# EAGLE schematic FPGA_DENDY_LAT (EAGLE 9.4.2)
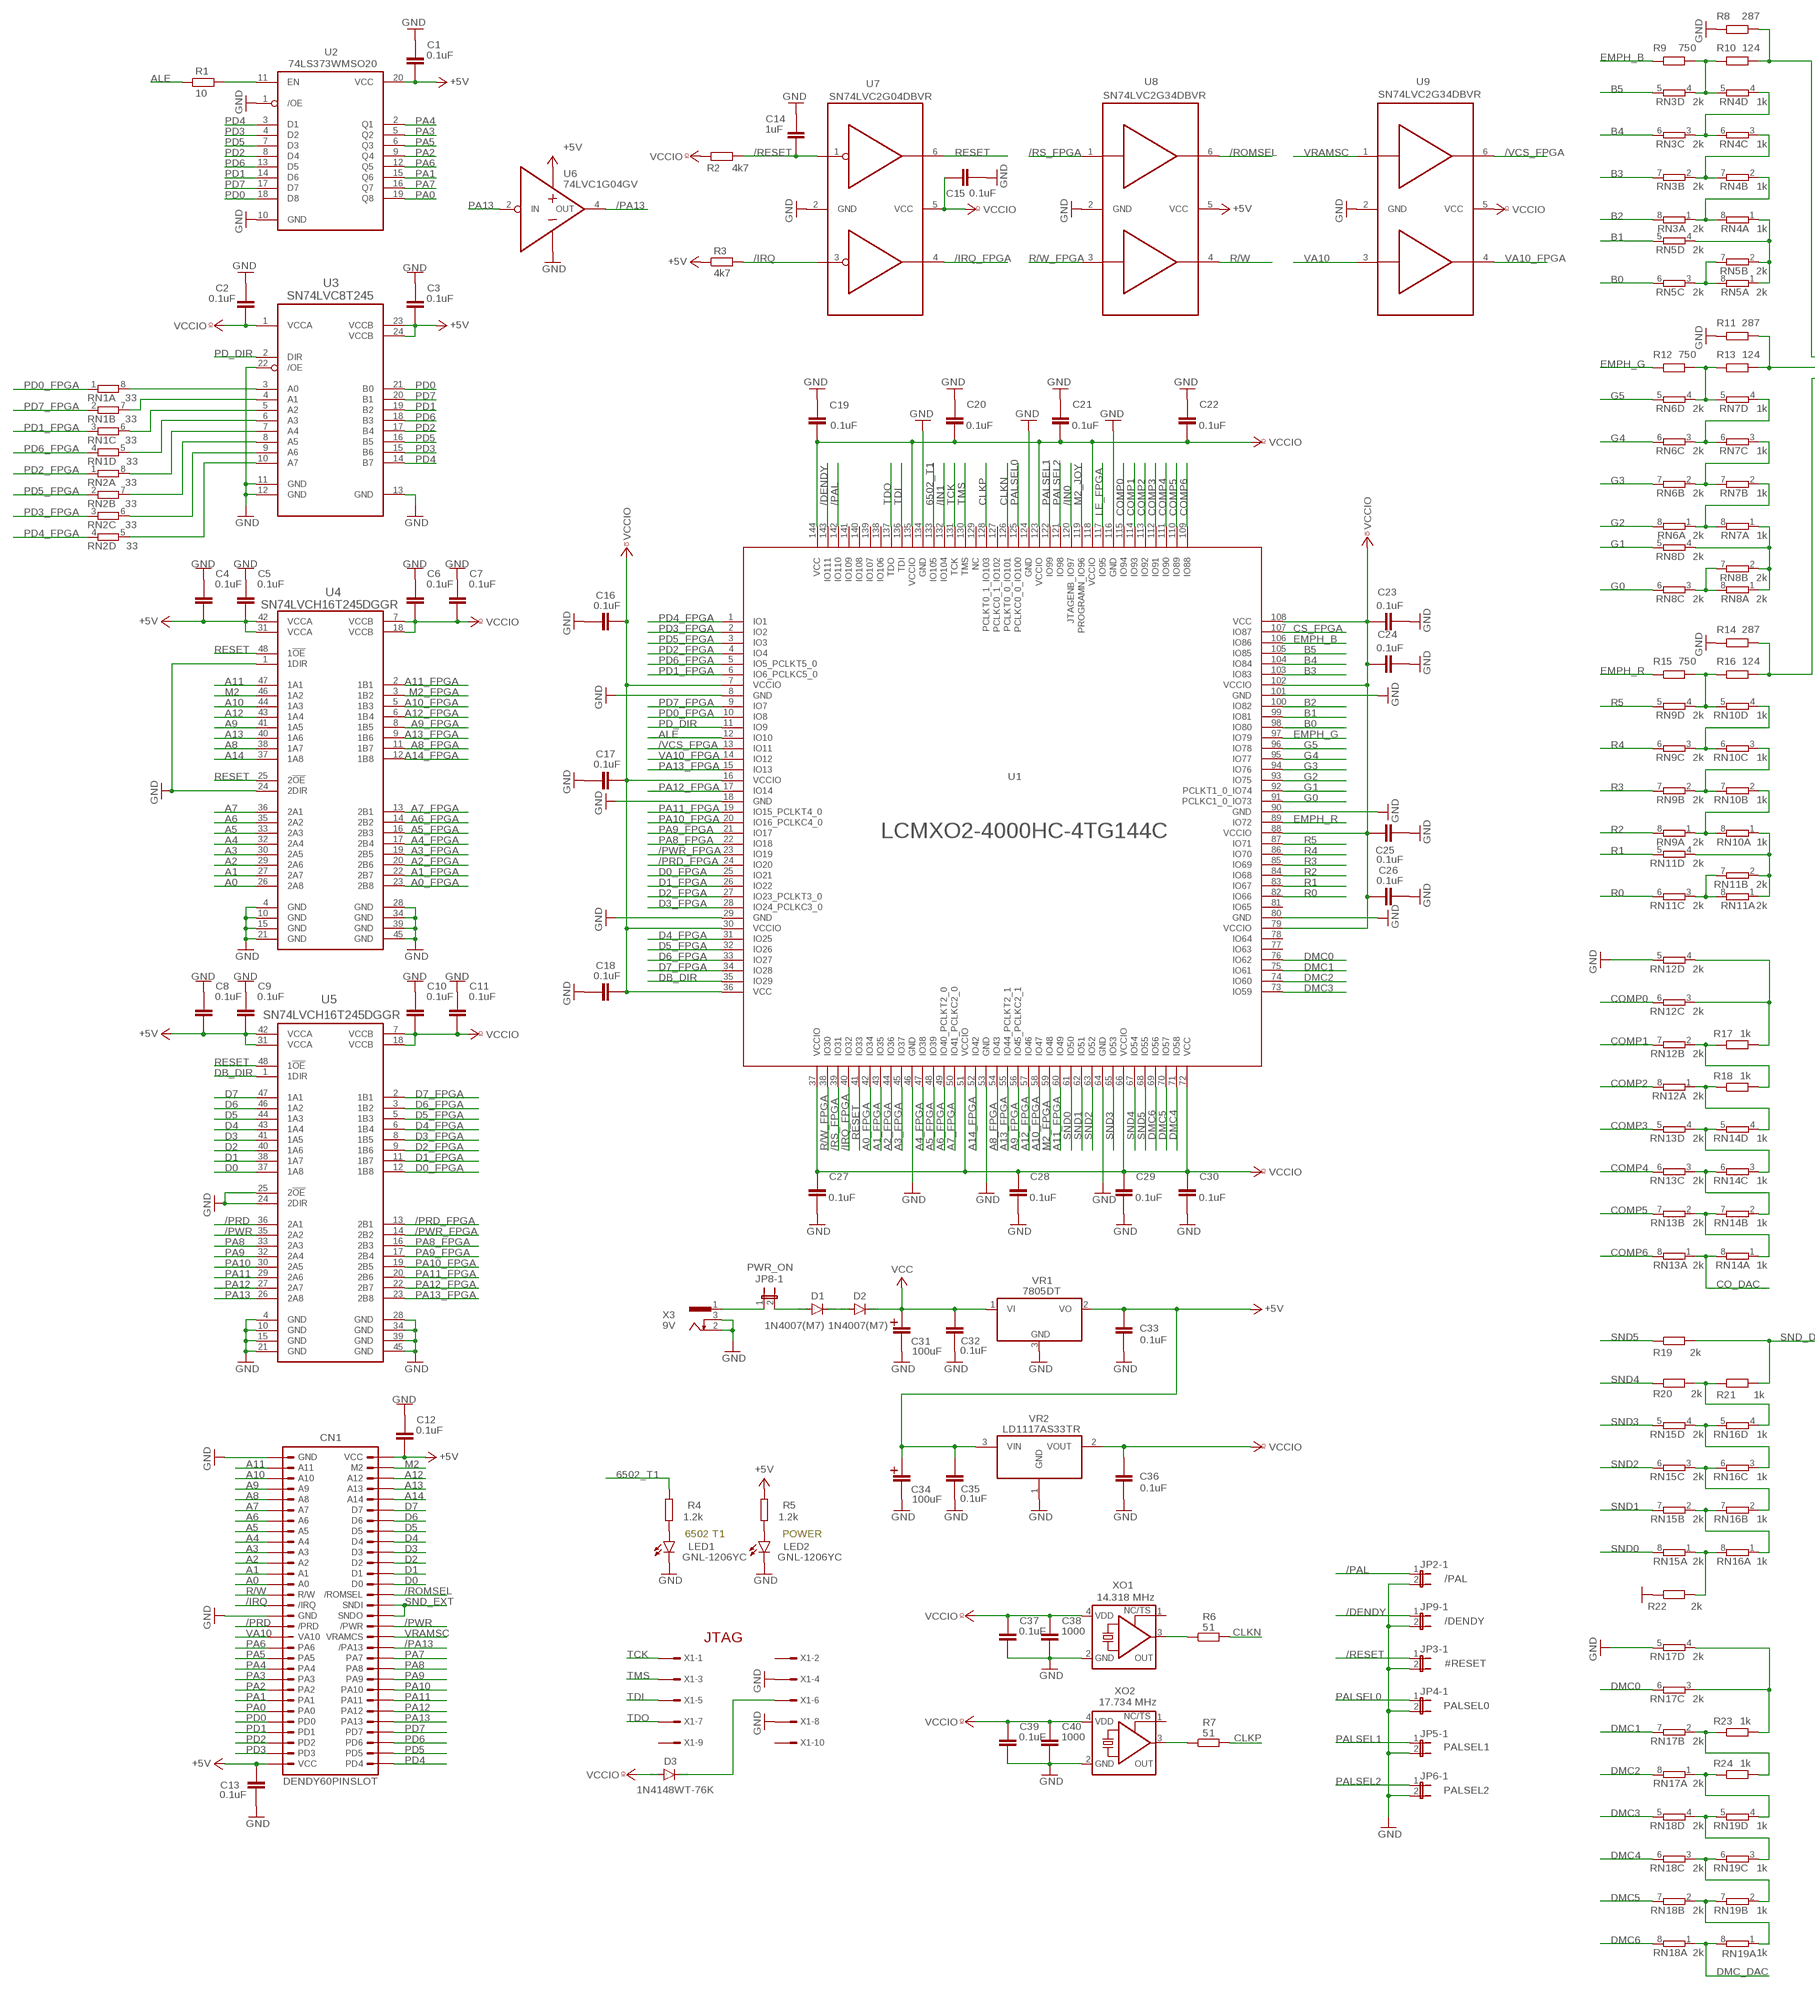
[diagram p0: schematic, sheet 1, part 1 of 2]
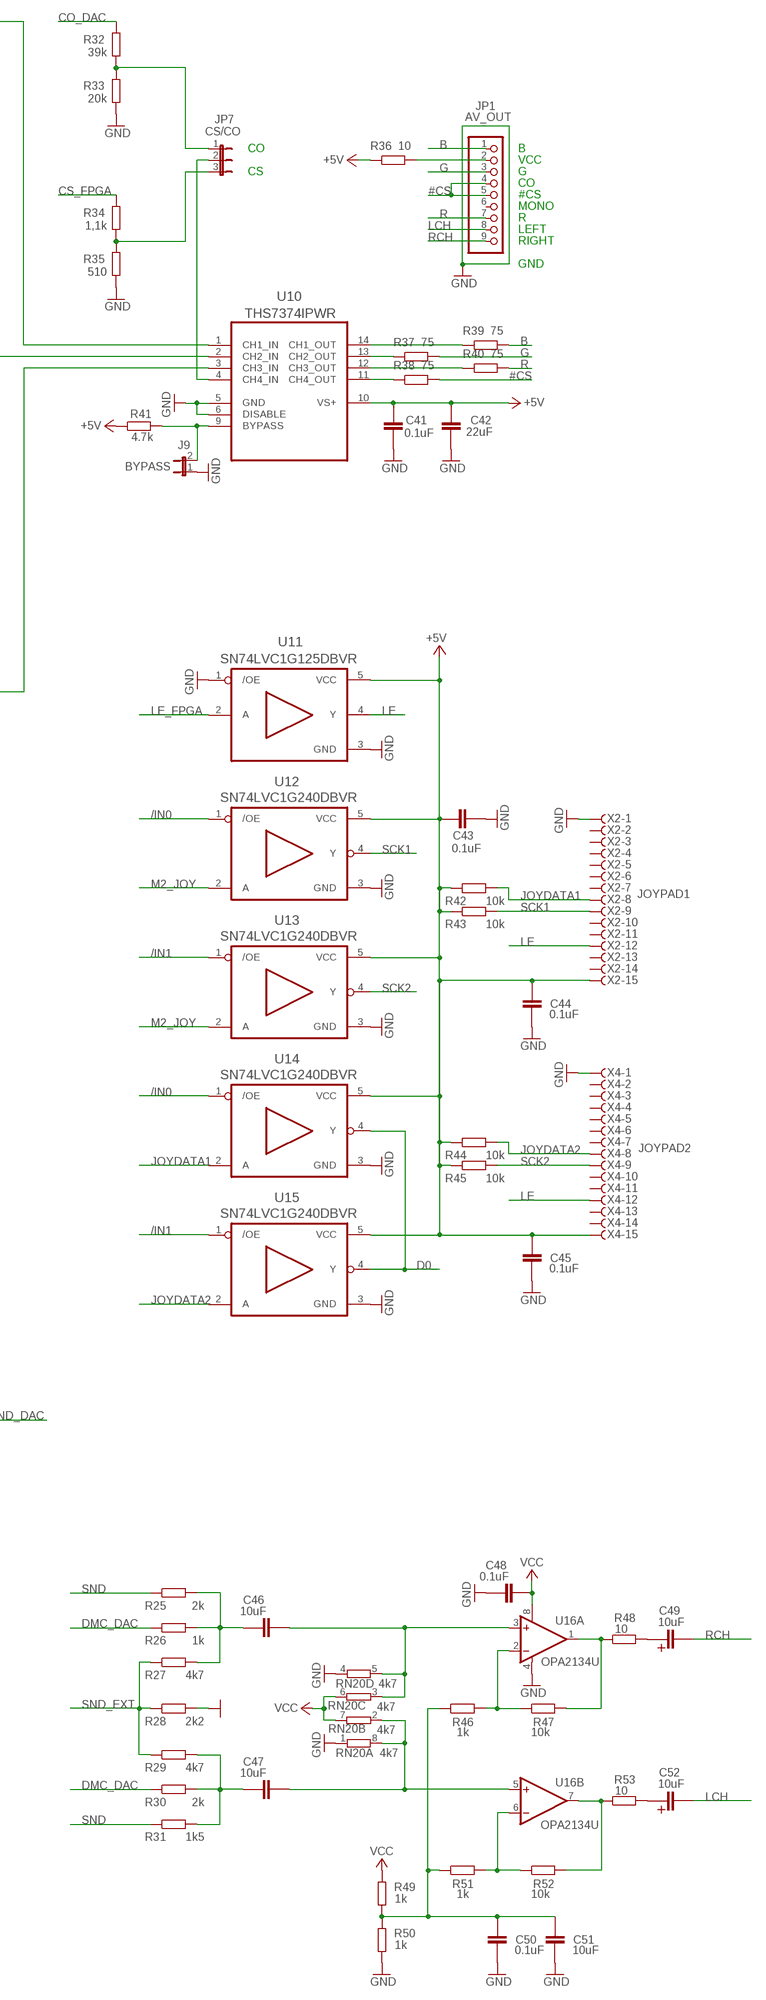
[diagram p1: schematic, sheet 1, part 2 of 2]

## Parts
C1  0.1uF  C-EUC0805  [C0805]
C2  0.1uF  C-EUC0805  [C0805]
C3  0.1uF  C-EUC0805  [C0805]
C4  0.1uF  C-EUC0805  [C0805]
C5  0.1uF  C-EUC0805  [C0805]
C6  0.1uF  C-EUC0805  [C0805]
C7  0.1uF  C-EUC0805  [C0805]
C8  0.1uF  C-EUC0805  [C0805]
C9  0.1uF  C-EUC0805  [C0805]
C10  0.1uF  C-EUC0805  [C0805]
C11  0.1uF  C-EUC0805  [C0805]
C12  0.1uF  C-EUC0805  [C0805]
C13  0.1uF  C-EUC0805  [C0805]
C14  1uF  C-EUC0805  [C0805]
C15  0.1uF  C-EUC0805  [C0805]
C16  0.1uF  C-EUC0805  [C0805]
C17  0.1uF  C-EUC0805  [C0805]
C18  0.1uF  C-EUC0805  [C0805]
C19  0.1uF  C-EUC0805  [C0805]
C20  0.1uF  C-EUC0805  [C0805]
C21  0.1uF  C-EUC0805  [C0805]
C22  0.1uF  C-EUC0805  [C0805]
C23  0.1uF  C-EUC0805  [C0805]
C24  0.1uF  C-EUC0805  [C0805]
C25  0.1uF  C-EUC0805  [C0805]
C26  0.1uF  C-EUC0805  [C0805]
C27  0.1uF  C-EUC0805  [C0805]
C28  0.1uF  C-EUC0805  [C0805]
C29  0.1uF  C-EUC0805  [C0805]
C30  0.1uF  C-EUC0805  [C0805]
C31  100uF  CPOL-EU153CLV-0505  [153CLV-0505]
C32  0.1uF  C-EUC0805  [C0805]
C33  0.1uF  C-EUC0805  [C0805]
C34  100uF  CPOL-EU153CLV-0505  [153CLV-0505]
C35  0.1uF  C-EUC0805  [C0805]
C36  0.1uF  C-EUC0805  [C0805]
C37  0.1uF  C-EUC0805  [C0805]
C38  1000  C-EUC0805  [C0805]
C39  0.1uF  C-EUC0805  [C0805]
C40  1000  C-EUC0805  [C0805]
C41  0.1uF  C-EUC0603  [C0603]
C42  22uF  C-EUC0603  [C0603]
C43  0.1uF  C-EUC0603  [C0603]
C44  0.1uF  C-EUC0805  [C0805]
C45  0.1uF  C-EUC0805  [C0805]
C46  10uF  C-EUC0805  [C0805]
C47  10uF  C-EUC0805  [C0805]
C48  0.1uF  C-EUC0805  [C0805]
C49  10uF  CPOL-EU153CLV-0505  [153CLV-0505]
C50  0.1uF  C-EUC0805  [C0805]
C51  10uF  C-EUC0805  [C0805]
C52  10uF  CPOL-EU153CLV-0505  [153CLV-0505]
CN1  DENDY60PINSLOT  [60PINDENDY]
D1  1N4007(M7)  DIODE-DO-214AC  [DO-214AC]
D2  1N4007(M7)  DIODE-DO-214AC  [DO-214AC]
D3  1N4148WT-76K  DIODE-DO214AA  [DO214AA]
J9  BYPASS  JP1E  [JP1]
JP1  AV_OUT  PINHD-1X9  [1X09]
JP2  /PAL  JP4QE  [JP4Q]
JP3  #RESET  JP4QE  [JP4Q]
JP4  PALSEL0  JP4QE  [JP4Q]
JP5  PALSEL1  JP4QE  [JP4Q]
JP6  PALSEL2  JP4QE  [JP4Q]
JP7  CS/CO  JP2W  [JP2W]
JP8  PWR_ON  JP4QE  [JP4Q]
JP9  /DENDY  JP4QE  [JP4Q]
LED1  GNL-1206YC  LEDSML1206  [SML1206]
LED2  GNL-1206YC  LEDSML1206  [SML1206]
R1  10  R-EU_R0805  [R0805]
R2  4k7  R-EU_R0805  [R0805]
R3  4k7  R-EU_R0805  [R0805]
R4  1.2k  R-EU_R0805  [R0805]
R5  1.2k  R-EU_R0805  [R0805]
R6  51  R-EU_R0805  [R0805]
R7  51  R-EU_R0805  [R0805]
R8  287  R-EU_R0805  [R0805]
R9  750  R-EU_R0805  [R0805]
R10  124  R-EU_R0805  [R0805]
R11  287  R-EU_R0805  [R0805]
R12  750  R-EU_R0805  [R0805]
R13  124  R-EU_R0805  [R0805]
R14  287  R-EU_R0805  [R0805]
R15  750  R-EU_R0805  [R0805]
R16  124  R-EU_R0805  [R0805]
R17  1k  R-EU_R0805  [R0805]
R18  1k  R-EU_R0805  [R0805]
R19  2k  R-EU_R0805  [R0805]
R20  2k  R-EU_R0805  [R0805]
R21  1k  R-EU_R0805  [R0805]
R22  2k  R-EU_R0805  [R0805]
R23  1k  R-EU_R0805  [R0805]
R24  1k  R-EU_R0805  [R0805]
R25  2k  R-EU_R0805  [R0805]
R26  1k  R-EU_R0805  [R0805]
R27  4k7  R-EU_R0805  [R0805]
R28  2k2  R-EU_R0805  [R0805]
R29  4k7  R-EU_R0805  [R0805]
R30  2k  R-EU_R0805  [R0805]
R31  1k5  R-EU_R0805  [R0805]
R32  39k  R-EU_R0805  [R0805]
R33  20k  R-EU_R0805  [R0805]
R34  1,1k  R-EU_R0805  [R0805]
R35  510  R-EU_R0805  [R0805]
R36  10  R-EU_R0805  [R0805]
R37  75  R-EU_R0805  [R0805]
R38  75  R-EU_R0805  [R0805]
R39  75  R-EU_R0805  [R0805]
R40  75  R-EU_R0805  [R0805]
R41  4.7k  R-EU_R0805  [R0805]
R42  10k  R-EU_R0805  [R0805]
R43  10k  R-EU_R0805  [R0805]
R44  10k  R-EU_R0805  [R0805]
R45  10k  R-EU_R0805  [R0805]
R46  1k  R-EU_R0805  [R0805]
R47  10k  R-EU_R0805  [R0805]
R48  10  R-EU_R0805  [R0805]
R49  1k  R-EU_R0805  [R0805]
R50  1k  R-EU_R0805  [R0805]
R51  1k  R-EU_R0805  [R0805]
R52  10k  R-EU_R0805  [R0805]
R53  10  R-EU_R0805  [R0805]
RN1  33  4R-N0603-ARC  [0603-ARC]
RN2  33  4R-N0603-ARC  [0603-ARC]
RN3  2k  4R-N0603-ARC  [0603-ARC]
RN4  1k  4R-N0603-ARC  [0603-ARC]
RN5  2k  4R-N0603-ARC  [0603-ARC]
RN6  2k  4R-N0603-ARC  [0603-ARC]
RN7  1k  4R-N0603-ARC  [0603-ARC]
RN8  2k  4R-N0603-ARC  [0603-ARC]
RN9  2k  4R-N0603-ARC  [0603-ARC]
RN10  1k  4R-N0603-ARC  [0603-ARC]
RN11  2k  4R-N0603-ARC  [0603-ARC]
RN12  2k  4R-N0603-ARC  [0603-ARC]
RN13  2k  4R-N0603-ARC  [0603-ARC]
RN14  1k  4R-N0603-ARC  [0603-ARC]
RN15  2k  4R-N0603-ARC  [0603-ARC]
RN16  1k  4R-N0603-ARC  [0603-ARC]
RN17  2k  4R-N0603-ARC  [0603-ARC]
RN18  2k  4R-N0603-ARC  [0603-ARC]
RN19  1k  4R-N0603-ARC  [0603-ARC]
RN20  4k7  4R-N0603-ARC  [0603-ARC]
U1  LCMXO2-4000HC-4TG144C  LCMXO2-4000HC  [TQFP144]
U2  74LS373WMSO20  [SO20W]
U3  SN74LVC8T245  [SOP65P640X110-24N]
U4  SN74LVCH16T245DGGR  [SOP50P810X120-48N]
U5  SN74LVCH16T245DGGR  [SOP50P810X120-48N]
U6  74LVC1G04GV  [SOT95P275X110-5N]
U7  SN74LVC2G04DBVR  [SOT-23-6]
U8  SN74LVC2G34DBVR  [SOT-23-6]
U9  SN74LVC2G34DBVR  [SOT-23-6]
U10  THS7374IPWR  [SOP65P640X120-14N]
U11  SN74LVC1G125DBVR  [SOT95P280X145-5N]
U12  SN74LVC1G240DBVR  [SOT95P280X145-5N]
U13  SN74LVC1G240DBVR  [SOT95P280X145-5N]
U14  SN74LVC1G240DBVR  [SOT95P280X145-5N]
U15  SN74LVC1G240DBVR  [SOT95P280X145-5N]
U16  OPA2134U  [SO08]
VR1  7805DT  [TO252]
VR2  LD1117AS33TR  [SOT230P700X180-4N]
X1  057-010-1  [057-010-1]
X2  JOYPAD1  F15HPS  [F15HP]
X3  9V  733980-62  [733980-62]
X4  JOYPAD2  F15HPS  [F15HP]
XO1  14.318 MHz  KXO-PXO/XO-V97  [7.0X5.08_KXO-(V)97]
XO2  17.734 MHz  KXO-PXO/XO-V95  [2.5X2.0_KXO-V95]

## Nets
6502_T1: R4.2 U1.133(IO105)
#CS: JP1.4 JP1.5 R38.2
+5V: C1.2 C3.2 C4.2 C5.2 C8.2 C9.2 C12.2 C13.1 C33.1 C34.+ C35.1 C41.2 C42.2 C43.2 C44.1 C45.1 CN1.A30(VCC) CN1.B1(VCC) R3.1 R5.2 R36.1 R41.1 R42.1 R43.1 R44.1 R45.1 U2.20(VCC) U3.23(VCCB) U3.24(VCCB) U4.31(VCCA) U4.42(VCCA) U5.31(VCCA) U5.42(VCCA) U6.5(VCC) U8.5(VCC) U10.10(VS+) U11.5(VCC) U12.5(VCC) U13.5(VCC) U14.5(VCC) U15.5(VCC) VR1.2(VO) VR2.3(VIN) X2.15(-15:F) X4.15(-15:F)
/DENDY: JP9.1 U1.143(IO111)
/IN0: U1.120(JTAGENB_IO97) U12.1(/OE) U14.1(/OE)
/IN1: U1.132(IO104) U13.1(/OE) U15.1(/OE)
/IRQ: CN1.A15(/IRQ) R3.2 U7.3(IN2)
/IRQ_FPGA: U1.40(IO32) U7.4(OUT2)
/PA13: CN1.B19(/PA13) U6.4(OUT)
/PAL: JP2.1 U1.142(IO110)
/PRD: CN1.A17(/PRD) U5.36(2A1)
/PRD_FPGA: U1.24(IO20) U5.13(2B1)
/PWR: CN1.B17(/PWR) U5.35(2A2)
/PWR_FPGA: U1.23(IO19) U5.14(2B2)
/RESET: C14.2 JP3.1 R2.2 U7.1(IN1)
/ROMSEL: CN1.B14(/ROMSEL) U8.6(OUT1)
/RS_FPGA: U1.39(IO31) U8.1(IN1)
/VCS_FPGA: U1.13(IO11) U9.6(OUT1)
A0: CN1.A13(A0) U4.26(2A8)
A0_FPGA: U1.42(IO34) U4.23(2B8)
A1: CN1.A12(A1) U4.27(2A7)
A1_FPGA: U1.43(IO35) U4.22(2B7)
A2: CN1.A11(A2) U4.29(2A6)
A2_FPGA: U1.44(IO36) U4.20(2B6)
A3: CN1.A10(A3) U4.30(2A5)
A3_FPGA: U1.45(IO37) U4.19(2B5)
A4: CN1.A9(A4) U4.32(2A4)
A4_FPGA: U1.47(IO38) U4.17(2B4)
A5: CN1.A8(A5) U4.33(2A3)
A5_FPGA: U1.48(IO39) U4.16(2B3)
A6: CN1.A7(A6) U4.35(2A2)
A6_FPGA: U1.49(IO40_PCLKT2_0) U4.14(2B2)
A7: CN1.A6(A7) U4.36(2A1)
A7_FPGA: U1.50(IO41_PCLKC2_0) U4.13(2B1)
A8: CN1.A5(A8) U4.38(1A7)
A8_FPGA: U1.54(IO43) U4.11(1B7)
A9: CN1.A4(A9) U4.41(1A5)
A9_FPGA: U1.56(IO45_PCLKC2_1) U4.8(1B5)
A10: CN1.A3(A10) U4.44(1A3)
A10_FPGA: U1.58(IO47) U4.5(1B3)
A11: CN1.A2(A11) U4.47(1A1)
A11_FPGA: U1.60(IO49) U4.2(1B1)
A12: CN1.B3(A12) U4.43(1A4)
A12_FPGA: U1.57(IO46) U4.6(1B4)
A13: CN1.B4(A13) U4.40(1A6)
A13_FPGA: U1.55(IO44_PCLKT2_1) U4.9(1B6)
A14: CN1.B5(A14) U4.37(1A8)
A14_FPGA: U1.52(IO42) U4.12(1B8)
ALE: R1.1 U1.12(IO10)
B: JP1.1 R39.2
B0: RN5.6 U1.98(IO80)
B1: RN5.5 U1.99(IO81)
B2: RN3.8 U1.100(IO82)
B3: RN3.7 U1.103(IO83)
B4: RN3.6 U1.104(IO84)
B5: RN3.5 U1.105(IO85)
CLKN: R6.2 U1.126(PCLKT0_0_IO101)
CLKP: R7.2 U1.128(PCLKT0_1_IO103)
CO_DAC: R32.2 RN13.1 RN14.8
COMP0: RN12.6 U1.115(IO94)
COMP1: RN12.7 U1.114(IO93)
COMP2: RN12.8 U1.113(IO92)
COMP3: RN13.5 U1.112(IO91)
COMP4: RN13.6 U1.111(IO90)
COMP5: RN13.7 U1.110(IO89)
COMP6: RN13.8 U1.109(IO88)
CS_FPGA: R34.2 U1.107(IO87)
D0: CN1.B13(D0) U5.37(1A8) U14.4(Y) U15.4(Y)
D0_FPGA: U1.25(IO21) U5.12(1B8)
D1: CN1.B12(D1) U5.38(1A7)
D1_FPGA: U1.26(IO22) U5.11(1B7)
D2: CN1.B11(D2) U5.40(1A6)
D2_FPGA: U1.27(IO23_PCLKT3_0) U5.9(1B6)
D3: CN1.B10(D3) U5.41(1A5)
D3_FPGA: U1.28(IO24_PCLKC3_0) U5.8(1B5)
D4: CN1.B9(D4) U5.43(1A4)
D4_FPGA: U1.31(IO25) U5.6(1B4)
D5: CN1.B8(D5) U5.44(1A3)
D5_FPGA: U1.32(IO26) U5.5(1B3)
D6: CN1.B7(D6) U5.46(1A2)
D6_FPGA: U1.33(IO27) U5.3(1B2)
D7: CN1.B6(D7) U5.47(1A1)
D7_FPGA: U1.34(IO28) U5.2(1B1)
DB_DIR: U1.35(IO29) U5.1(1DIR)
DMC0: RN17.6 U1.76(IO62)
DMC1: RN17.7 U1.75(IO61)
DMC2: RN17.8 U1.74(IO60)
DMC3: RN18.5 U1.73(IO59)
DMC4: RN18.6 U1.71(IO58)
DMC5: RN18.7 U1.70(IO57)
DMC6: RN18.8 U1.69(IO56)
DMC_DAC: R26.1 R30.1 RN18.1 RN19.8
EMPH_B: R9.1 U1.106(IO86)
EMPH_G: R12.1 U1.97(IO79)
EMPH_R: R15.1 U1.89(IO72)
G: JP1.3 R37.2
G0: RN8.6 U1.91(PCLKC1_0_IO73)
G1: RN8.5 U1.92(PCLKT1_0_IO74)
G2: RN6.8 U1.93(IO75)
G3: RN6.7 U1.94(IO76)
G4: RN6.6 U1.95(IO77)
G5: RN6.5 U1.96(IO78)
GND: C1.1 C2.1 C3.1 C4.1 C5.1 C6.1 C7.1 C8.1 C9.1 C10.1 C11.1 C12.1 C13.2 C14.1 C15.2 C16.1 C17.1 C18.1 C19.2 C20.1 C21.1 C22.1 C23.2 C24.2 C25.2 C26.2 C27.2 C28.2 C29.2 C30.2 C31.- C32.2 C33.2 C34.- C35.2 C36.2 C37.2 C38.2 C39.2 C40.2 C41.1 C42.1 C43.1 C44.2 C45.2 C48.1 C50.2 C51.2 CN1.A1(GND) CN1.A16(GND) J9.1 JP2.2 JP3.2 JP4.2 JP5.2 JP6.2 JP9.2 LED1.C LED2.C R8.1 R11.1 R14.1 R22.1 R28.2 R33.1 R35.1 R50.2 RN12.5 RN17.5 RN20.1 RN20.4 U1.8(GND) U1.18(GND) U1.29(GND) U1.46(GND) U1.53(GND) U1.64(GND) U1.80(GND) U1.90(GND) U1.101(GND) U1.116(GND) U1.124(GND) U1.134(GND) U2.1(/OE) U2.10(GND) U3.11(GND) U3.12(GND) U3.13(GND) U3.22(/OE) U4.1(1DIR) U4.4(GND) U4.10(GND) U4.15(GND) U4.21(GND) U4.24(2DIR) U4.28(GND) U4.34(GND) U4.39(GND) U4.45(GND) U5.4(GND) U5.10(GND) U5.15(GND) U5.21(GND) U5.24(2DIR) U5.25(2!OE) U5.28(GND) U5.34(GND) U5.39(GND) U5.45(GND) U6.3(GND) U7.2(GND) U8.2(GND) U9.2(GND) U10.5(GND) U10.6(DISABLE) U11.1(/OE) U11.3(GND) U12.3(GND) U13.3(GND) U14.3(GND) U15.3(GND) U16.4(A:V-) VR1.3(GND) VR2.1(GND) X1.4 X1.8 X2.1(-1:F) X3.2 X3.3 X4.1(-1:F) XO1.2(GND) XO2.2(GND)
JOYDATA1: R42.2 U14.2(A) X2.8(-8:F)
JOYDATA2: R44.2 U15.2(A) X4.8(-8:F)
LCH: C52.- JP1.8
LE: U11.4(Y) X2.12(-12:F) X4.12(-12:F)
LE_FPGA: U1.117(IO95) U11.2(A)
M2: CN1.B2(M2) U4.46(1A2)
M2_FPGA: U1.59(IO48) U4.3(1B2)
M2_JOY: U1.119(PROGRAMN_IO96) U12.2(A) U13.2(A)
N$1: C46.1 R25.2 R26.2 R27.2
N$2: R7.1 XO2.3(OUT)
N$3: D3.C X1.6
N$4: C46.2 RN20.3 RN20.5 U16.3(A:+IN)
N$5: RN18.2 RN19.1 RN19.7
N$6: R6.1 XO1.3(OUT)
N$7: C47.2 RN20.2 RN20.8 U16.5(B:+IN)
N$8: R20.2 R21.1 RN16.4
N$9: RN1.8 U3.3(A0)
N$10: RN1.7 U3.4(A1)
N$11: RN13.2 RN14.1 RN14.7
N$12: RN1.6 U3.5(A2)
N$13: RN1.5 U3.6(A3)
N$14: R9.2 R10.1 RN3.4 RN4.5
N$15: R51.2 R52.1 U16.6(B:-IN)
N$16: RN3.3 RN4.4 RN4.6
N$17: RN2.8 U3.7(A4)
N$18: RN3.2 RN4.3 RN4.7
N$19: JP7.3 R34.1 R35.2
N$20: RN13.3 RN14.2 RN14.6
N$21: RN13.4 RN14.3 RN14.5
N$22: R17.2 RN12.3 RN12.4
N$23: RN3.1 RN4.2 RN4.8
N$24: R12.2 R13.1 RN6.4 RN7.5
N$25: RN6.3 RN7.4 RN7.6
N$26: RN6.2 RN7.3 RN7.7
N$27: RN4.1 RN5.1 RN5.2 RN5.4
N$28: RN6.1 RN7.2 RN7.8
N$29: RN5.3 RN5.7 RN5.8
N$30: C47.1 R29.2 R30.2 R31.2
N$31: RN2.7 U3.8(A5)
N$32: RN2.6 U3.9(A6)
N$33: RN7.1 RN8.1 RN8.2 RN8.4
N$34: R15.2 R16.1 RN9.4 RN10.5
N$35: RN9.3 RN10.4 RN10.6
N$36: RN8.3 RN8.7 RN8.8
N$37: C49.+ R48.2
N$38: R11.2 R13.2 U10.2(CH2_IN)
N$39: RN9.2 RN10.3 RN10.7
N$40: RN9.1 RN10.2 RN10.8
N$41: RN10.1 RN11.1 RN11.2 RN11.4
N$42: R46.2 R47.1 U16.2(A:-IN)
N$43: R47.2 R48.1 U16.1(A:OUT)
N$44: R52.2 R53.1 U16.7(B:OUT)
N$45: C52.+ R53.2
N$46: R18.1 RN12.1 RN14.4
N$47: R17.1 R18.2 RN12.2
N$49: JP7.1 R32.1 R33.2
N$50: JP1.2 R36.2
N$52: R1.2 U2.11(EN)
N$53: R14.2 R16.2 U10.3(CH3_IN)
N$54: LED1.A R4.1
N$55: RN15.4 RN16.3 RN16.5
N$56: J9.2 R41.2 U10.9(BYPASS)
N$57: RN15.3 RN16.2 RN16.6
N$58: R8.2 R10.2 U10.1(CH1_IN)
N$59: RN15.2 RN16.1 RN16.7
N$60: R22.2 RN15.1 RN16.8
N$61: RN2.5 U3.10(A7)
N$62: JP7.2 U10.4(CH4_IN)
N$63: LED2.A R5.1
N$64: R39.1 U10.14(CH1_OUT)
N$65: R37.1 U10.13(CH2_OUT)
N$66: R40.1 U10.12(CH3_OUT)
N$67: R38.1 U10.11(CH4_OUT)
N$68: RN18.3 RN19.2 RN19.6
N$69: RN18.4 RN19.3 RN19.5
N$70: R23.2 RN17.3 RN17.4
N$71: RN11.3 RN11.7 RN11.8
N$72: R24.1 RN17.1 RN19.4
N$73: R23.1 R24.2 RN17.2
N$75: D1.A JP8.2
N$76: D1.C D2.A
N$77: JP8.1 X3.1
PA0: CN1.A25(PA0) U2.19(Q8)
PA1: CN1.A24(PA1) U2.15(Q6)
PA2: CN1.A23(PA2) U2.9(Q4)
PA3: CN1.A22(PA3) U2.5(Q2)
PA4: CN1.A21(PA4) U2.2(Q1)
PA5: CN1.A20(PA5) U2.6(Q3)
PA6: CN1.A19(PA6) U2.12(Q5)
PA7: CN1.B20(PA7) U2.16(Q7)
PA8: CN1.B21(PA8) U5.33(2A3)
PA8_FPGA: U1.22(IO18) U5.16(2B3)
PA9: CN1.B22(PA9) U5.32(2A4)
PA9_FPGA: U1.21(IO17) U5.17(2B4)
PA10: CN1.B23(PA10) U5.30(2A5)
PA10_FPGA: U1.20(IO16_PCLKC4_0) U5.19(2B5)
PA11: CN1.B24(PA11) U5.29(2A6)
PA11_FPGA: U1.19(IO15_PCLKT4_0) U5.20(2B6)
PA12: CN1.B25(PA12) U5.27(2A7)
PA12_FPGA: U1.17(IO14) U5.22(2B7)
PA13: CN1.B26(PA13) U5.26(2A8) U6.2(IN)
PA13_FPGA: U1.15(IO13) U5.23(2B8)
PALSEL0: JP4.1 U1.125(PCLKC0_0_IO100)
PALSEL1: JP5.1 U1.122(IO99)
PALSEL2: JP6.1 U1.121(IO98)
PD0: CN1.A26(PD0) U2.18(D8) U3.21(B0)
PD0_FPGA: RN1.1 U1.10(IO8)
PD1: CN1.A27(PD1) U2.14(D6) U3.19(B2)
PD1_FPGA: RN1.3 U1.6(IO6_PCLKC5_0)
PD2: CN1.A28(PD2) U2.8(D4) U3.17(B4)
PD2_FPGA: RN2.1 U1.4(IO4)
PD3: CN1.A29(PD3) U2.4(D2) U3.15(B6)
PD3_FPGA: RN2.3 U1.2(IO2)
PD4: CN1.B30(PD4) U2.3(D1) U3.14(B7)
PD4_FPGA: RN2.4 U1.1(IO1)
PD5: CN1.B29(PD5) U2.7(D3) U3.16(B5)
PD5_FPGA: RN2.2 U1.3(IO3)
PD6: CN1.B28(PD6) U2.13(D5) U3.18(B3)
PD6_FPGA: RN1.4 U1.5(IO5_PCLKT5_0)
PD7: CN1.B27(PD7) U2.17(D7) U3.20(B1)
PD7_FPGA: RN1.2 U1.9(IO7)
PD_DIR: U1.11(IO9) U3.2(DIR)
R: JP1.7 R40.2
R0: RN11.6 U1.82(IO66)
R1: RN11.5 U1.83(IO67)
R2: RN9.8 U1.84(IO68)
R3: RN9.7 U1.85(IO69)
R4: RN9.6 U1.86(IO70)
R5: RN9.5 U1.87(IO71)
R/W: CN1.A14(R/W) U8.4(OUT2)
R/W_FPGA: U1.38(IO30) U8.3(IN2)
RCH: C49.- JP1.9
RESET: U1.41(IO33) U4.25(2!OE) U4.48(1!OE) U5.48(1!OE) U7.6(OUT1)
SCK1: R43.2 U12.4(Y) X2.9(-9:F)
SCK2: R45.2 U13.4(Y) X4.9(-9:F)
SND: R25.1 R31.1
SND0: RN15.8 U1.61(IO50)
SND1: RN15.7 U1.62(IO51)
SND2: RN15.6 U1.63(IO52)
SND3: RN15.5 U1.65(IO53)
SND4: R20.1 U1.67(IO54)
SND5: R19.1 U1.68(IO55)
SND_DAC: R19.2 R21.2
SND_EXT: CN1.B15(SNDI) CN1.B16(SNDO) R27.1 R28.1 R29.1
TCK: U1.131(TCK) X1.1
TDI: U1.136(TDI) X1.5
TDO: U1.137(TDO) X1.7
TMS: U1.130(TMS) X1.3
VA10: CN1.A18(VA10) U9.3(IN2)
VA10_FPGA: U1.14(IO12) U9.4(OUT2)
VCC: C31.+ C32.1 C48.2 D2.C R49.1 RN20.6 RN20.7 U16.8(A:V+) VR1.1(VI)
VCCIO: C2.2 C6.2 C7.2 C10.2 C11.2 C15.1 C16.2 C17.2 C18.2 C19.1 C20.2 C21.2 C22.2 C23.1 C24.1 C25.1 C26.1 C27.1 C28.1 C29.1 C30.1 C36.1 C37.1 C38.1 C39.1 C40.1 D3.A R2.1 U1.7(VCCIO) U1.16(VCCIO) U1.30(VCCIO) U1.36(VCC) U1.37(VCCIO) U1.51(VCCIO) U1.66(VCCIO) U1.72(VCC) U1.79(VCCIO) U1.88(VCCIO) U1.102(VCCIO) U1.108(VCC) U1.118(VCCIO) U1.123(VCCIO) U1.135(VCCIO) U1.144(VCC) U3.1(VCCA) U4.7(VCCB) U4.18(VCCB) U5.7(VCCB) U5.18(VCCB) U7.5(VCC) U9.5(VCC) VR2.2(VOUT) XO1.4(VDD) XO2.4(VDD)
VPPL3: C50.1 C51.1 R46.1 R49.2 R50.1 R51.1
VRAMSC: CN1.B18(VRAMCS) U9.1(IN1)
Unconnected: JP1.6 JP2.3 JP2.4 JP2.5 JP2.6 JP2.7 JP2.8 JP3.3 JP3.4 JP3.5 JP3.6 JP3.7 JP3.8 JP4.3 JP4.4 JP4.5 JP4.6 JP4.7 JP4.8 JP5.3 JP5.4 JP5.5 JP5.6 JP5.7 JP5.8 JP6.3 JP6.4 JP6.5 JP6.6 JP6.7 JP6.8 JP8.3 JP8.4 JP8.5 JP8.6 JP8.7 JP8.8 JP9.3 JP9.4 JP9.5 JP9.6 JP9.7 JP9.8 U1.77(IO63) U1.78(IO64) U1.81(IO65) U1.127(PCLKC0_1_IO102) U1.129(NC) U1.138(IO106) U1.139(IO107) U1.140(IO108) U1.141(IO109) X1.2 X1.9 X1.10 X2.2(-2:F) X2.3(-3:F) X2.4(-4:F) X2.5(-5:F) X2.6(-6:F) X2.7(-7:F) X2.10(-10:F) X2.11(-11:F) X2.13(-13:F) X2.14(-14:F) X2.G1(-G:G1) X2.G2(-G:G2) X4.2(-2:F) X4.3(-3:F) X4.4(-4:F) X4.5(-5:F) X4.6(-6:F) X4.7(-7:F) X4.10(-10:F) X4.11(-11:F) X4.13(-13:F) X4.14(-14:F) X4.G1(-G:G1) X4.G2(-G:G2) XO1.1(TS) XO2.1(TS)

## Notes on the sheet
- CO | B
- VCC
- CS | G
- CO
- #CS
- MONO
- R
- LEFT
- RIGHT
- GND
- 6502 T1 | POWER
- JTAG

## Library data of the parts
C1-C30 C32 C33 C35-C48 C50 C51 = rcl_my:C-EU: CAPACITOR, European symbol; SPICEPREFIX: C
C31 C34 C49 C52 = rcl_my:CPOL-EU: POLARIZED CAPACITOR, European symbol; SPICEPREFIX: C
CN1 = DENDY60pin:DENDY60PINSLOT
D1-D3 = diode:DIODE-: DIODE
J9 = jumper:JP1E: JUMPER
JP1 = pinhead:PINHD-1X9: PIN HEADER
JP2-JP6 JP8 JP9 = jumper:JP4QE: JUMPER
JP7 = jumper:JP2W: JUMPER
LED1 LED2 = led:LED: LED OSRAM: - CHIPLED LG R971, LG N971, LY N971, LG Q971, LY Q971, LO R971, LY R971 LH N974, LH R974 LS Q976, LO Q976, LY Q976 LO Q996 - Hyper CHIPLED LW Q18S LB Q993, LB Q99A, LB R99A - SideLED LS A670, LO A670, LY A670, LG A670, LP A670 LB A673, LV A673, LT A673, LW A673 LH A674 LY A675 LS A676, LA A676, LO A676, LY A676, LW A676 LS A679, LY A679, LG A679 - Hyper Micro SIDELED® LS Y876, LA Y876, LO Y876, LY Y876 LT Y87S - SmartLED LW L88C, LW L88S LB L89C, LB L89S, LG L890 LS L89K, LO L89K, LY L89K LS L896, LA L896, LO L896, LY L896 - TOPLED LS T670, LO T670, LY T670, LG T670, LP T670 LSG T670, LSP T670, LSY T670, LOP T670, LYG T670 LG T671, LOG T671, LSG T671 LB T673, LV T673, LT T673, LW T673 LH T674 LS T676, LA T676, LO T676, LY T676, LB T676, LH T676, LSB T676, LW T676 LB T67C, LV T67C, LT T67C, LS T67K, LO T67K, LY T67K, LW E67C LS E67B, LA E67B, LO E67B, LY E67B, LB E67C, LV E67C, LT E67C LW T67C LS T679, LY T679, LG T679 LS T770, LO T770, LY T770, LG T770, LP T770 LB T773, LV T773, LT T773, LW T773 LH T774 LS E675, LA E675, LY E675, LS T675 LS T776, LA T776, LO T776, LY T776, LB T776 LHGB T686 LT T68C, LB T68C - Hyper Mini TOPLED® LB M676 - Mini TOPLED Santana® LG M470 LS M47K, LO M47K, LY M47K Source: http://www.osram.convergy.de LUXEON: - LUMILED® LXK2-PW12-R00, LXK2-PW12-S00, LXK2-PW14-U00, LXK2-PW14-V00 LXK2-PM12-R00, LXK2-PM12-S00, LXK2-PM14-U00 LXK2-PE12-Q00, LXK2-PE12-R00, LXK2-PE12-S00, LXK2-PE14-T00, LXK2-PE14-U00 LXK2-PB12-K00, LXK2-PB12-L00, LXK2-PB12-M00, LXK2-PB14-N00, LXK2-PB14-P00, LXK2-PB14-Q00 LXK2-PR12-L00, LXK2-PR12-M00, LXK2-PR14-Q00, LXK2-PR14-R00 LXK2-PD12-Q00, LXK2-PD12-R00, LXK2-PD12-S00 LXK2-PH12-R00, LXK2-PH12-S00 LXK2-PL12-P00, LXK2-PL12-Q00, LXK2-PL12-R00 Source: www.luxeon.com KINGBRIGHT: KA-3528ASYC Source: www.kingbright.com
R1-R53 = rcl:R-EU_: RESISTOR, European symbol; SPICEPREFIX: R
RN1-RN20 = resistor-dil:4R-N: Array Chip Resistor Source: RS Component / Phycomp; OC_FARNELL: unknown; OC_NEWARK: unknown
U1 = LCMXO2-4000HC:LCMXO2-4000HC
U2 = 74LS373WM:74LS373WM
U3 = SN74LVC8T245:SN74LVC8T245
U4 U5 = SN74LVCH16T245DGGR:SN74LVCH16T245DGGR: Check availability <https://pricing.snapeda.com/parts/SN74LVCH16T245DGGR/Texas%20Instruments/view-part?ref=eda>; AVAILABILITY: In Stock; CHECK_PRICES: https://www.snapeda.com/parts/SN74LVCH16T245DGGR/Texas+Instruments/view-part/?ref=eda; DESCRIPTION: 16-Bit Dual-Supply Bus Transceiver, Configurable Voltage Translation, 3-State Outputs; MF: Texas Instruments; MP: SN74LVCH16T245DGGR; PACKAGE: TSSOP-48 Texas Instruments; PRICE: None; SNAPEDA_LINK: https://www.snapeda.com/parts/SN74LVCH16T245DGGR/Texas+Instruments/view-part/?ref=snap
U6 = 74LVC1G04GV:74LVC1G04GV
U7 = SN74LVC2G04DBVR:SN74LVC2G04DBVR
U8 U9 = SN74LVC2G34DBVR:SN74LVC2G34DBVR
U10 = THS7374IPWR:THS7374IPWR
U11 = SN74LVC1G125DBVR:SN74LVC1G125DBVR
U12-U15 = SN74LVC1G240DBVR:SN74LVC1G240DBVR
U16 = burr-brown:OPA2134: Operational Amplifier; MF: TEXAS INSTRUMENTS; MPN: OPA2134UA; OC_FARNELL: 1206935; OC_NEWARK: 35C1847
VR1 = linear stab:78*: Positive VOLTAGE REGULATOR Source: http://cache.national.com/ds/LM/LM78L05.pdf http://www.fairchildsemi.com/ds/LM/LM7805.pdf
VR2 = LD1117AS33TR:LD1117AS33TR
X1 = con-panduit:057-010-: CONNECTOR 10-pin series 057 contact pc board low profile headers; OC_FARNELL: unknown; OC_NEWARK: unknown
X2 X4 = con-subd:F15HPS: SUB-D; OC_FARNELL: unknown; OC_NEWARK: unknown
X3 = con-conrad:73398?: FEMALE PRINT CONNECTOR Niedervolt-Steckverbinder Distributor Conrad
XO1 XO2 = crystal-geyer_V1_0:KXO-PXO/XO-V: Clock Oscillator (PXO/XO) MHz : KXO-V - Serie Model Size l/w/h [mm] Frequency Range Frequency Stability Temp. Range [°C] Output AECQ 200 availabel Datasheet KXO-V94 KXO-V94 KXO-V95 KXO-V95 KXO-V96 KXO-V96 KXO-V99 KXO-V99 KXO-97 KXO-V97 KXO-97 - KXO-V97 2.0/1.6/0.80 2.0/1.6/0.80 2.5/2.0/0.82 2.5/2.0/0.82 3.2/2.5/1.2 3.2/2.5/1.2 5.0/3.2/1.2 5.0/3.2/1.2 7.0/5.08/1.3 7.0/5.08/1.3 7.0/5.08/1.3 32,768 kHz 1,0 ~ 80,0 MHz 32,768 kHz 1,0 ~ 70,0 MHz 32,768 kHz 1,0 ~ 156,0 MHz 32,768 kHz 1,0 ~ 200,0 MHz 32,768 kHz 32,768 kHz 1,0 ~ 160,0 MHz ±25 … ±100ppm ±25 … ±100ppm ±25 … ±100ppm ±25 … ±100ppm ±25 … ±100ppm ±25 … ±100ppm ±25 … ±100ppm ±25 … ±100ppm ±25 … ±100ppm ±25 … ±100ppm ±25 … ±100ppm (*) -40°C …+85°C (*) -40°C …+85°C (*) -40°C …+85°C (*) -40°C …+85°C (*) -40°C …+85°C (*) -40°C …+85°C (*) -40°C …+85°C (*) -40°C …+85°C (*) -40°C …+85°C (*) -40°C …+85°C (*) -40°C …+85°C HCMOS HCMOS HCMOS HCMOS HCMOS HCMOS HCMOS HCMOS HCMOS HCMOS HCMOS - - yes yes yes yes - - - - - KXO-V94-kHz.pdf <http://www.geyer-electronic.de/uploads/tx_userartikelfrequenz/GEYER-KXO-V94-kHz.pdf> KXO-V94.pdf <http://www.geyer-electronic.de/uploads/tx_userartikelfrequenz/GEYER-KXO-V94.pdf> KXO-V95-kHz.pdf <http://www.geyer-electronic.de/uploads/tx_userartikelfrequenz/GEYER-KXO-V95-kHz.pdf> KXO-V95.pdf <http://www.geyer-electronic.de/uploads/tx_userartikelfrequenz/GEYER-KXO-V95.pdf> KXO-V96-kHz.pdf <http://www.geyer-electronic.de/uploads/tx_userartikelfrequenz/GEYER-KXO-V96-kHz.pdf> KXO-V96.pdf <http://www.geyer-electronic.de/uploads/tx_userartikelfrequenz/GEYER-KXO-V96.pdf> KXO-V99-kHz.pdf <http://www.geyer-electronic.de/uploads/tx_userartikelfrequenz/GEYER-KXO-V99-kHz.pdf> KXO-V99.pdf <http://www.geyer-electronic.de/uploads/tx_userartikelfrequenz/GEYER-KXO-V99.pdf> KXO-97-kHz.pdf <http://www.geyer-electronic.de/uploads/tx_userartikelfrequenz/GEYER-KXO-97-kHz.pdf> KXO-V97-kHz.pdf <http://www.geyer-electronic.de/uploads/tx_userartikelfrequenz/GEYER-KXO-V97-kHz.pdf> KXO-V97.pdf <http://www.geyer-electronic.de/uploads/tx_userartikelfrequenz/GEYER-KXO-V97.pdf> <http://www.geyer-electronic.de/fileadmin/template/img/logo-geyer-electronic.png> Details see: http://www.geyer-electronic.de/Frequenz-Produkte.9.0.html Created 2016-06-07, Hans Locher 2016 (C) Geyer Quartz Technology Hans Locher KXOV94,KXOV95;KXOV96;KXOV97;KXO97;2016;2520;3225;5032;70508;2,5x2,0;3,2x2,5;5,0x3,2;7,0x5,08;2.5x2.0;3.2x2.5;5.0x3.2;7.0x5.08;